# EAGLE design DAMAVA_02 (EAGLE 8.2.2)
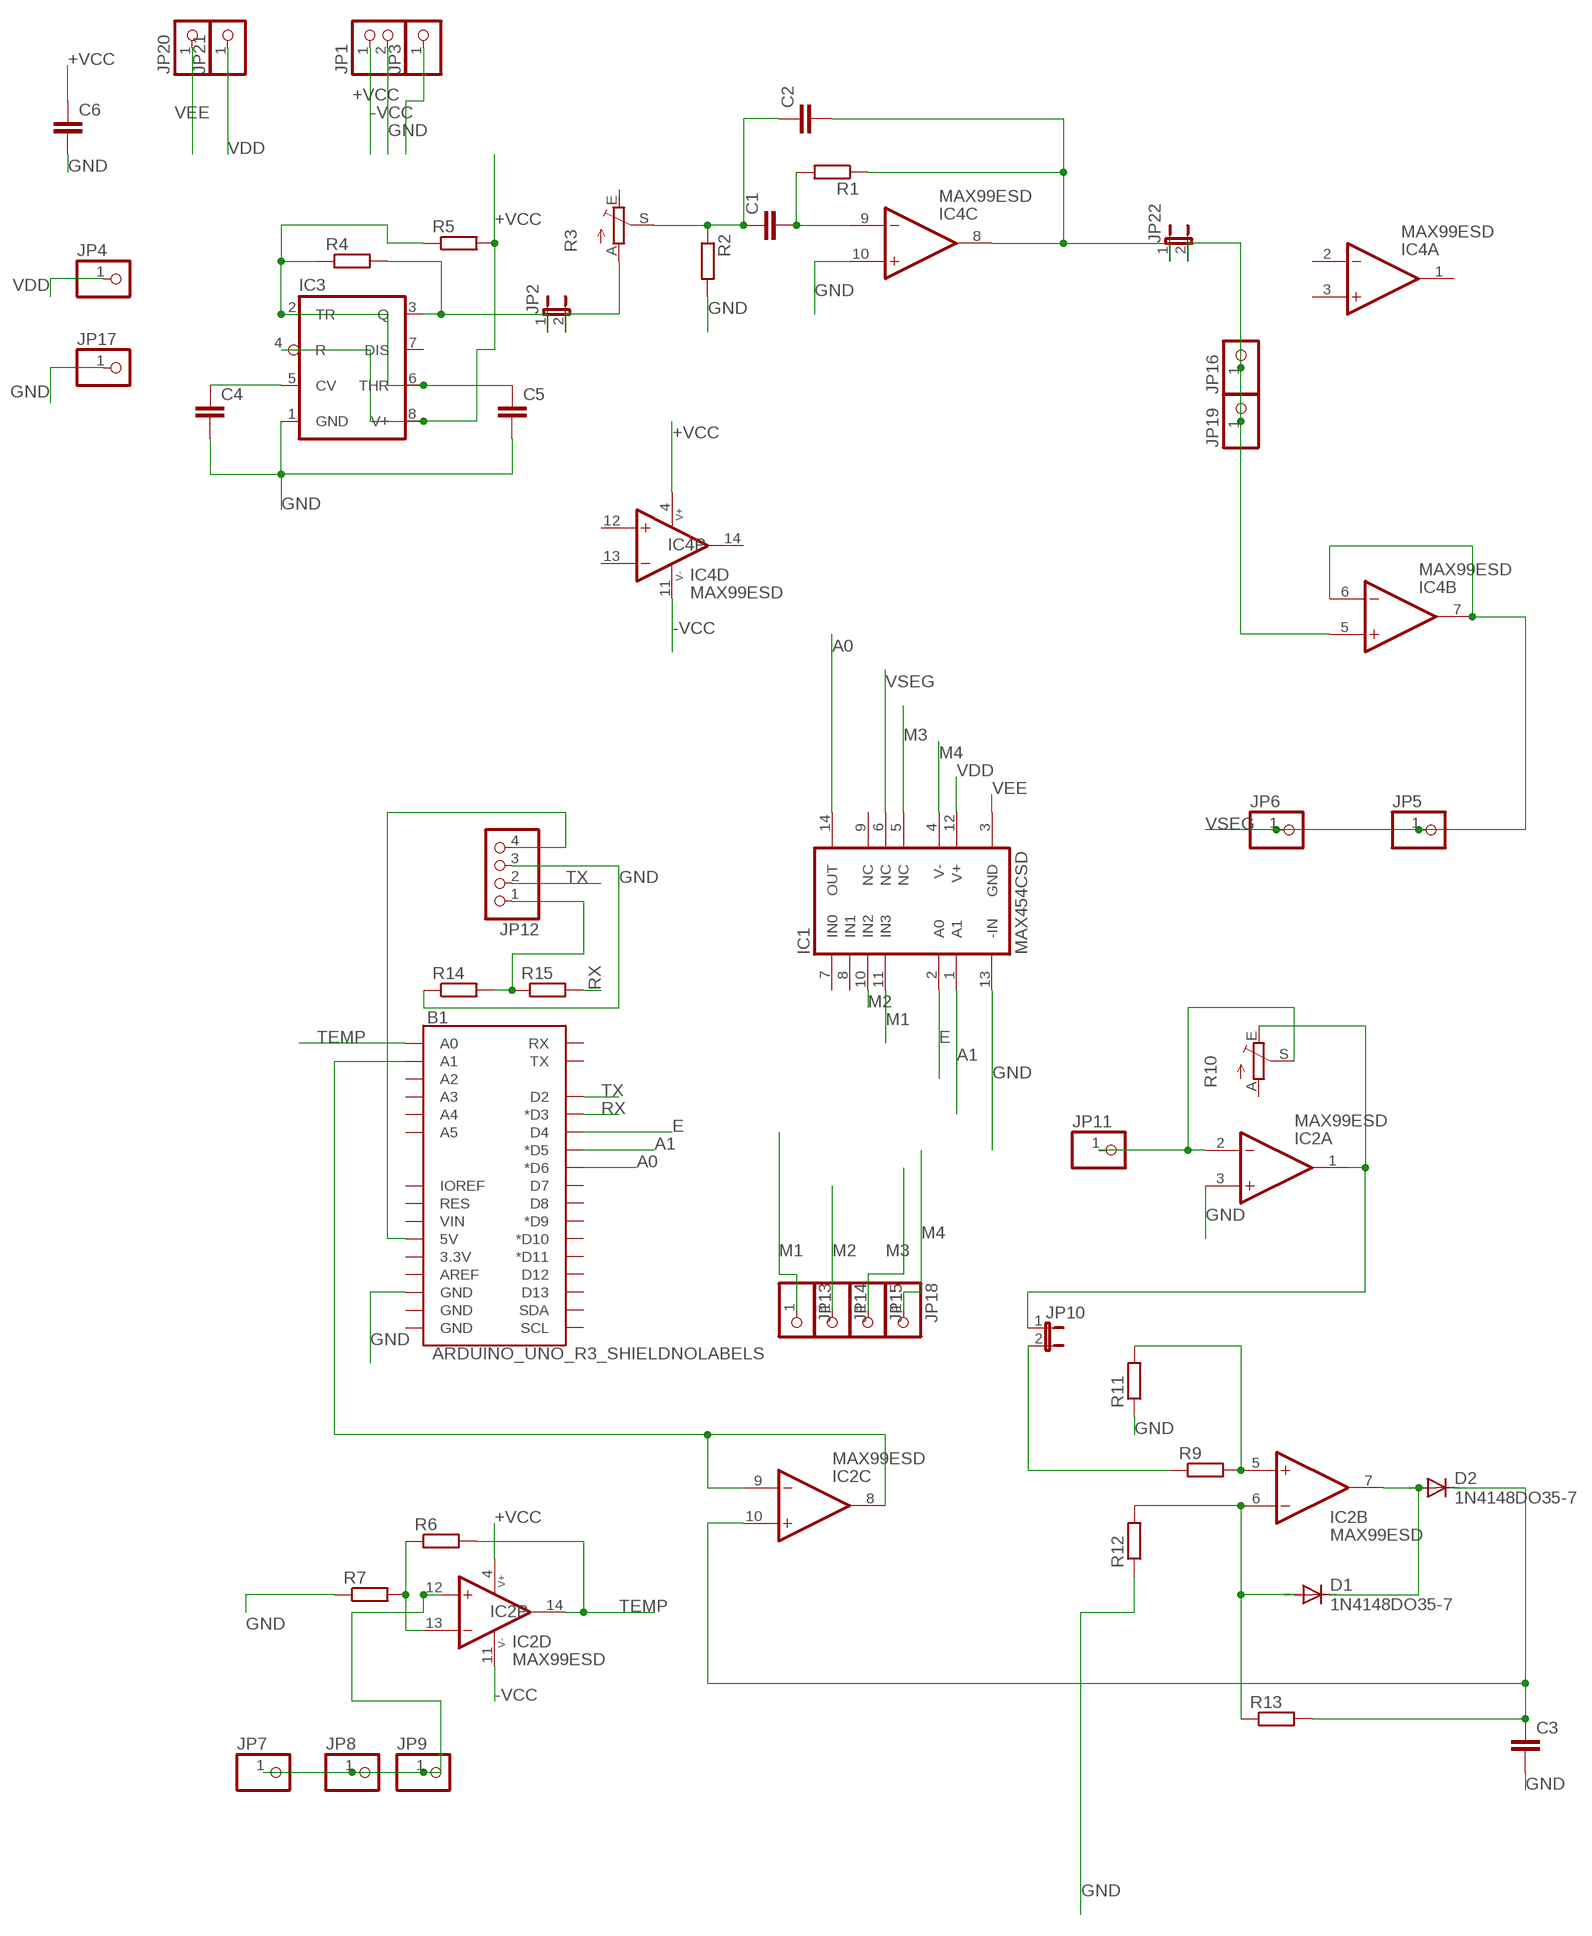
[diagram p0: schematic, sheet 1]

## Parts
B1  ARDUINO_UNO_R3_SHIELDNOLABELS  [UNO_R3_SHIELD_NOLABELS]
C1  C-EU050-024X044  [C050-024X044]
C2  C-EU050-024X044  [C050-024X044]
C3  C5/2.5  [C5B2.5]
C4  C-EU050-024X044  [C050-024X044]
C5  C-EU050-024X044  [C050-024X044]
C6  C-EU050-024X044  [C050-024X044]
D1  1N4148DO35-7  [DO35-7]
D2  1N4148DO35-7  [DO35-7]
IC1  MAX454CSD  [SO14]
IC2  MAX99ESD  [SO14]
IC3  TLC555DIL08-2  [DIL08-2]
IC4  MAX99ESD  [SO14]
JP1  PINHD-1X2  [1X02]
JP2  JP1E  [JP1]
JP3  PINHD-1X1  [1X01]
JP4  PINHD-1X1  [1X01]
JP5  PINHD-1X1  [1X01]
JP6  PINHD-1X1  [1X01]
JP7  PINHD-1X1  [1X01]
JP8  PINHD-1X1  [1X01]
JP9  PINHD-1X1  [1X01]
JP10  JP1E  [JP1]
JP11  PINHD-1X1  [1X01]
JP12  PINHD-1X4  [1X04]
JP13  PINHD-1X1  [1X01]
JP14  PINHD-1X1  [1X01]
JP15  PINHD-1X1  [1X01]
JP16  PINHD-1X1  [1X01]
JP17  PINHD-1X1  [1X01]
JP18  PINHD-1X1  [1X01]
JP19  PINHD-1X1  [1X01]
JP20  PINHD-1X1  [1X01]
JP21  PINHD-1X1  [1X01]
JP22  JP1E  [JP1]
R1  R-EU_0204/5  [0204/5]
R2  R-EU_0204/5  [0204/5]
R3  TRIM_EU-B90P  [SP19L]
R4  R-EU_0204/5  [0204/5]
R5  R-EU_0204/5  [0204/5]
R6  R-EU_0204/5  [0204/5]
R7  R-EU_0204/5  [0204/5]
R9  R-EU_0204/5  [0204/5]
R10  TRIM_EU-B90P  [SP19L]
R11  R-EU_0204/5  [0204/5]
R12  R-EU_0204/5  [0204/5]
R13  R-EU_0204/5  [0204/5]
R14  R-EU_0204/5  [0204/5]
R15  R-EU_0204/5  [0204/5]

## Nets
+VCC: C6.1 IC2.4(P:V+) IC3.4(R) IC3.8(V+) IC4.4(P:V+) JP1.1 R5.2
-VCC: IC2.11(P:V-) IC4.11(P:V-) JP1.2
A0: B1.D6(*D6) IC1.14(OUT)
A1: B1.D5(*D5) IC1.1(A1)
E: B1.D4 IC1.2(A0)
GND: B1.GND@2(GND) C3.2 C4.2 C5.2 C6.2 IC1.13(-IN) IC2.3(A:+IN) IC3.1(GND) IC4.10(C:+IN) JP3.1 JP12.3 JP17.1 R2.2 R7.1 R11.1 R12.1 R14.1
M1: IC1.11(IN3) JP13.1
M2: IC1.10(IN2) JP14.1
M3: IC1.5(NC) JP15.1
M4: IC1.4(V-) JP18.1
N$1: C1.2 IC4.9(C:-IN) R1.2
N$2: C1.1 C2.1 R2.1 R3.S
N$3: JP2.2 R3.A
N$4: C5.1 IC3.2(TR) IC3.6(THR) R4.1 R5.1
N$5: IC3.3(Q) JP2.1 R4.2
N$6: C3.1 D2.C IC2.10(C:+IN) R13.2
N$7: IC2.13(D:-IN) R6.1 R7.2
N$8: IC4.5(B:+IN) JP16.1 JP19.1 JP22.2
N$9: IC2.12(D:+IN) JP7.1 JP8.1 JP9.1
N$17: IC2.2(A:-IN) JP11.1 R10.S
N$19: B1.A1 IC2.8(C:OUT) IC2.9(C:-IN)
N$22: IC2.1(A:OUT) JP10.1 R10.E
N$23: IC2.5(B:+IN) R9.2 R11.2
N$24: JP10.2 R9.1
N$25: JP12.1 R14.2 R15.1
N$26: C2.2 IC4.8(C:OUT) JP22.1 R1.1
N$28: D1.A IC2.6(B:-IN) R12.2 R13.1
N$29: D1.C D2.A IC2.7(B:OUT)
N$31: B1.5V JP12.4
N$32: C4.1 IC3.5(CV)
RX: B1.D3(*D3) R15.2
TEMP: B1.A0 IC2.14(D:OUT) R6.2
TX: B1.D2 JP12.2
VDD: IC1.12(V+) JP4.1 JP21.1
VEE: IC1.3(GND) JP20.1
VSEG: IC1.6(NC) IC4.6(B:-IN) IC4.7(B:OUT) JP5.1 JP6.1
Unconnected: B1.3.3V B1.A2 B1.A3 B1.A4 B1.A5 B1.AREF B1.D7 B1.D8 B1.D9(*D9) B1.D10(*D10) B1.D11(*D11) B1.D12 B1.D13 B1.GND@0(GND) B1.GND@1(GND) B1.IOREF B1.RES B1.RX B1.SCL B1.SDA B1.TX B1.VIN IC1.7(IN0) IC1.8(IN1) IC1.9(NC) IC3.7(DIS) IC4.1(A:OUT) IC4.2(A:-IN) IC4.3(A:+IN) IC4.12(D:+IN) IC4.13(D:-IN) IC4.14(D:OUT) R3.E R10.A

## Library data of the parts
B1 = SparkFun-Boards:ARDUINO_UNO_R3_SHIELD: Arduino R3 Shield Footprint Shield form compatible with the Arduino Uno R3. SparkFun Products: MG2639 Cellular Shield <https://www.sparkfun.com/products/13120> MIDI Shield <https://www.sparkfun.com/products/12898> R3 Stackable Headers Kit <https://www.sparkfun.com/products/11417>
C1 C2 C4-C6 = resistor:C-EU: CAPACITOR, European symbol
C3 = capacitor-wima:C: CAPACITOR naming: grid - package width
D1 D2 = diode:1N4148: DIODE high speed (Philips)
IC1 = maxim:MAX454CSD: MULTIPLEXER; MPN: MAX454CSD+; OC_FARNELL: unknown; OC_NEWARK: 67K5327
IC2 IC4 = maxim:MAX99*: Micropower, Low-Voltage Rail-to-Rail I/O Comparators Source: http://pdfserv.maxim-ic.com/en/ds/MAX985-MAX994.pdf; OC_FARNELL: unknown; OC_NEWARK: unknown
IC3 = my_mixed:TLC555: CMOS 555 timer
JP1 = pinhead:PINHD-1X2: PIN HEADER
JP2 JP10 JP22 = jumper:JP1E: JUMPER
JP3-JP9 JP11 JP13-JP21 = pinhead:PINHD-1X1: PIN HEADER
JP12 = pinhead:PINHD-1X4: PIN HEADER
R1 R2 R4-R7 R9 R11-R15 = resistor:R-EU_: RESISTOR, European symbol
R3 R10 = pot:TRIM_EU-: POTENTIOMETER

## Module MUX
Ports: 

### Library data of the parts

## Board
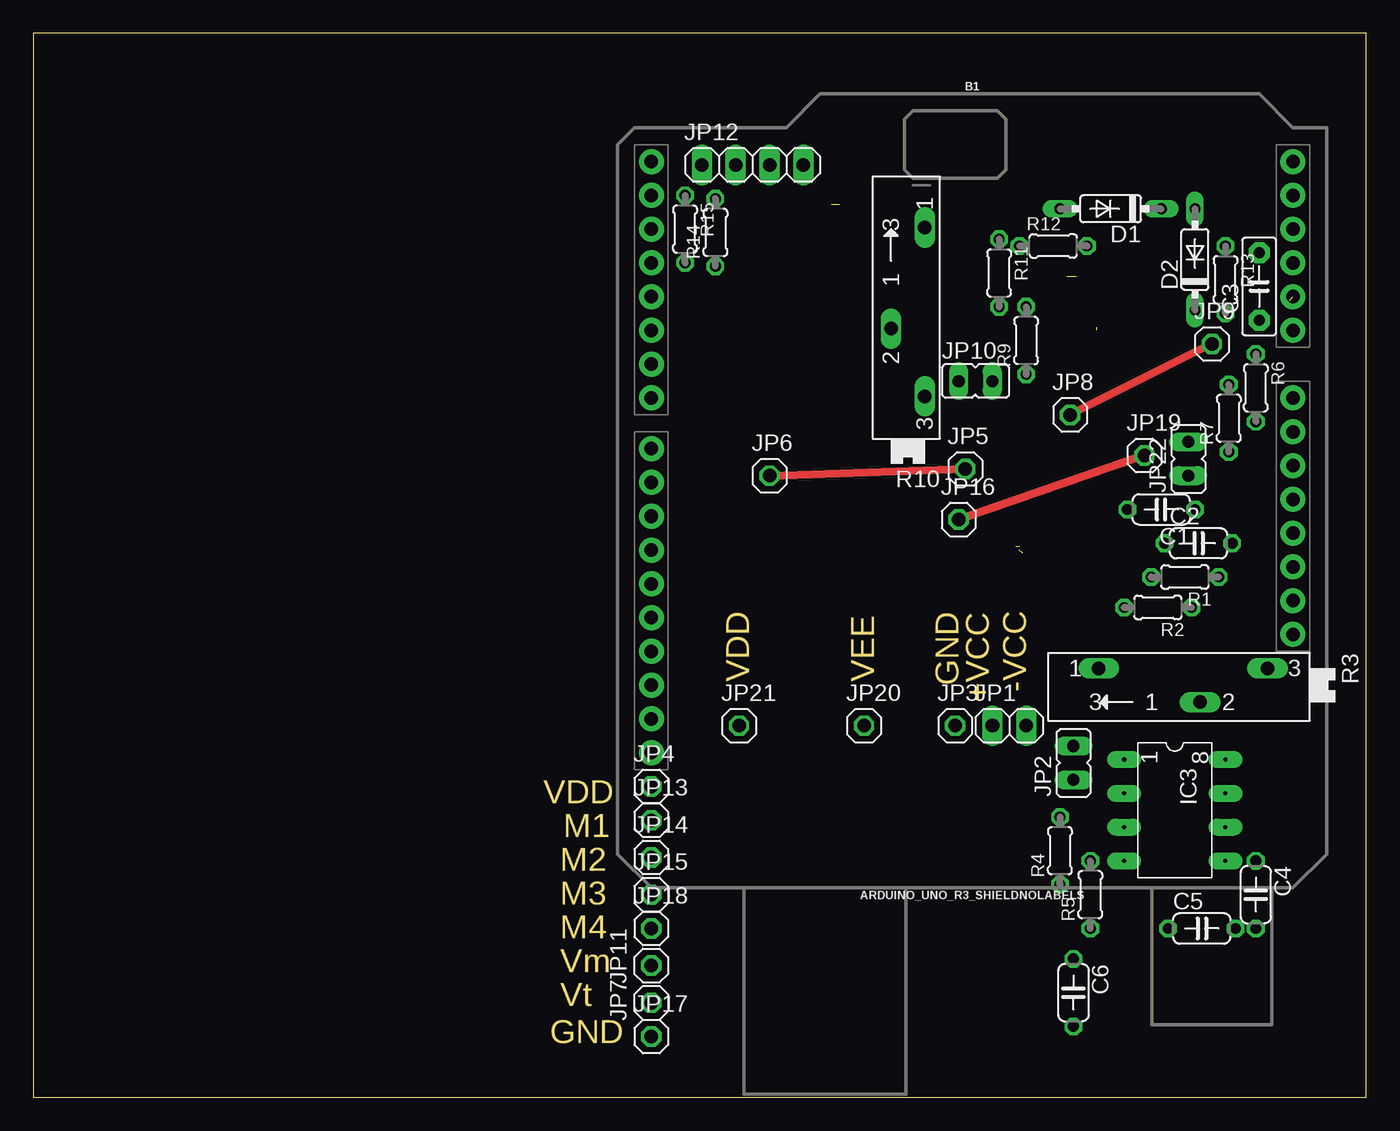
[diagram p1: board, top side]
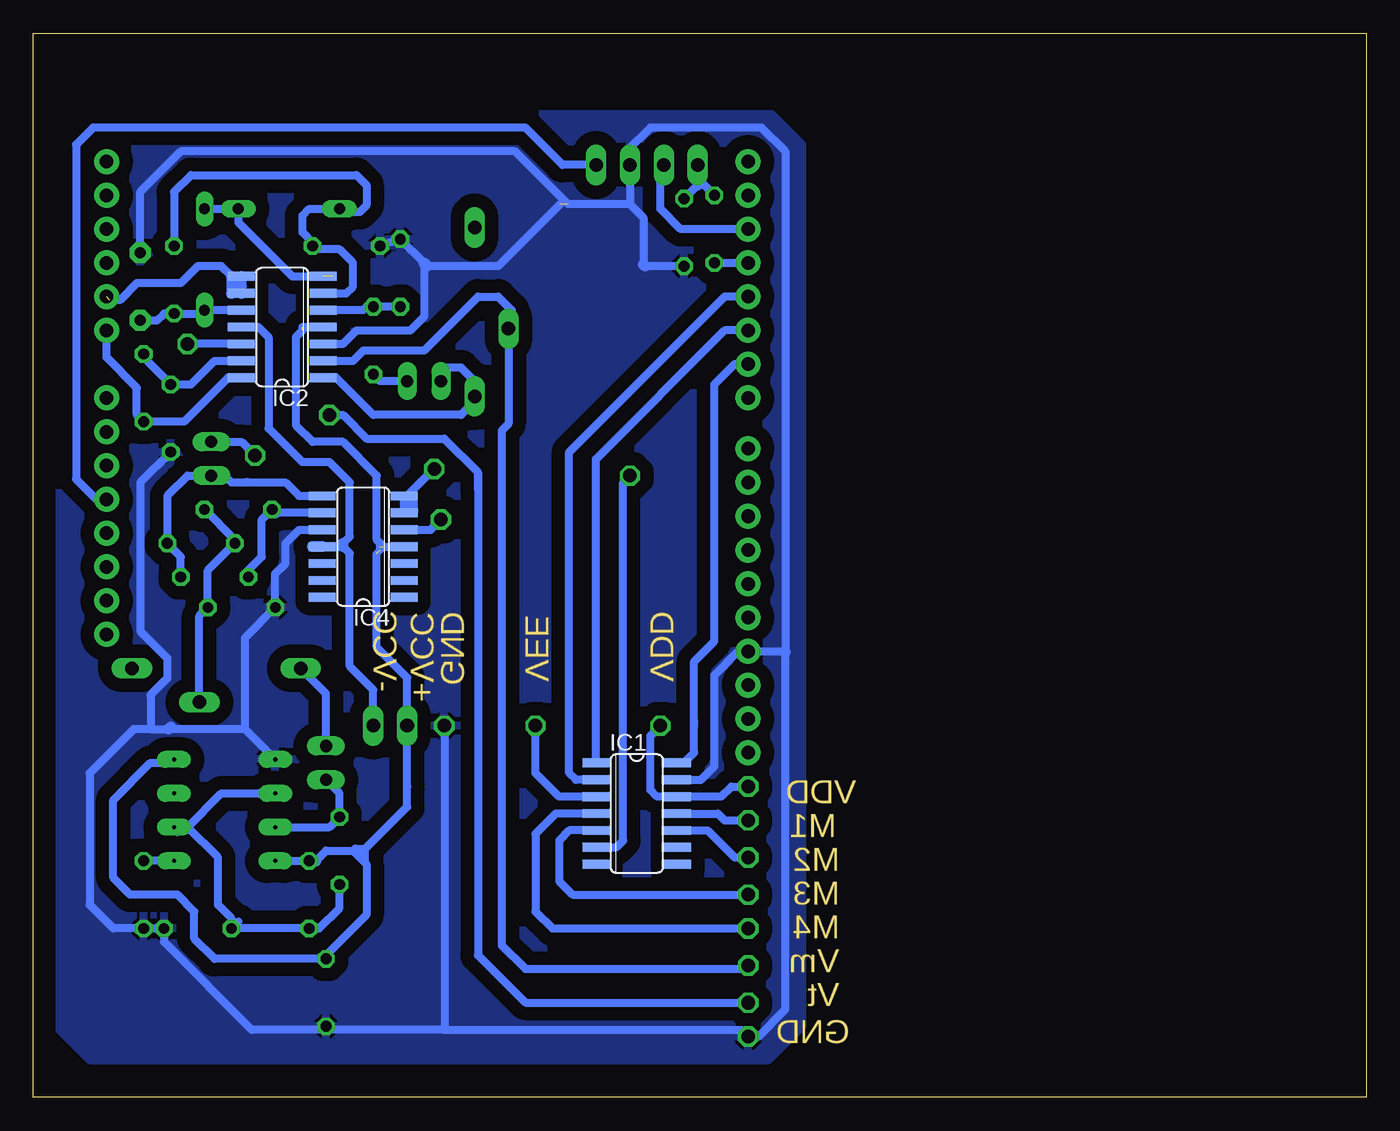
[diagram p2: board, bottom side, seen from below]

Size 100.25 x 80 mm. Coordinates in mm from the lower left corner, seen from the top.
Outline: 0,0 100.25,0 100.25,80 0,80 0,0
Copper layers (1*16): Top 0.035mm / dielectric 1.5mm / Bottom 0.035mm
Design rules "default": minimum track width 6mil, minimum drill 0.35mm, track to track 6mil, track to pad 6mil, pad to pad 6mil, via to via 6mil, smd to smd 6mil, copper to edge 40mil, drill to drill 6mil, minimum pad ring 10mil, minimum via ring 8mil, stop-mask expansion 4mil, vias tented up to drill 0mil, thermal gap 10mil

### Footprints (pad centres in the part's own frame; a part is rotated, then mirrored left to right if it is on the bottom)
UNO_R3_SHIELD_NOLABELS = drill 1.016 pad 1.88: 3.3V 24.13,-3.81; 5V 24.13,-1.27; A0 24.13,11.43; A1 24.13,13.97; A2 24.13,16.51; A3 24.13,19.05; A4 24.13,21.59; A5 24.13,24.13; AREF -24.13,-15.24; D2 -24.13,19.05; D3 -24.13,16.51; D4 -24.13,13.97; D5 -24.13,11.43; D6 -24.13,8.89; D7 -24.13,6.35; D8 -24.13,2.54; D9 -24.13,0; D10 -24.13,-2.54; D11 -24.13,-5.08; D12 -24.13,-7.62; D13 -24.13,-10.16; GND@0 24.13,1.27; GND@1 24.13,3.81; GND@2 -24.13,-12.7; IOREF 24.13,-8.89; NC 24.13,-11.43; RES 24.13,-6.35; RX -24.13,24.13; SCL -24.13,-20.32; SDA -24.13,-17.78; TX -24.13,21.59; VIN 24.13,6.35
C050-024X044 = drill 0.813 octagon: 1 -2.54,0; 2 2.54,0
C5B2.5 = drill 0.813 pad 1.6 octagon: 1 -2.54,0; 2 2.54,0
DO35-7 = drill 0.813 long: A 3.81,0; C -3.81,0
SO14 = smd 0.66 x 2.032: 1 -3.81,-3.073; 2 -2.54,-3.073; 3 -1.27,-3.073; 4 0,-3.073; 5 1.27,-3.073; 6 2.54,-3.073; 7 3.81,-3.073; 8 3.81,3.073; 9 2.54,3.073; 10 1.27,3.073; 11 0,3.073; 12 -1.27,3.073; 13 -2.54,3.073; 14 -3.81,3.073
DIL08-2 = drill 0.305 pad 1.27 long: 1 -3.81,-3.81; 2 -1.27,-3.81; 3 1.27,-3.81; 4 3.81,-3.81; 5 3.81,3.81; 6 1.27,3.81; 7 -1.27,3.81; 8 -3.81,3.81
1X02 = drill 1.016 long: 1 -1.27,0; 2 1.27,0
JP1 = drill 0.914 long: 1 0,-1.27; 2 0,1.27
1X01 = drill 1.016 octagon: 1 0,0
1X04 = drill 1.016 long: 1 -3.81,0; 2 -1.27,0; 3 1.27,0; 4 3.81,0
0204/5 = drill 0.813 octagon: 1 -2.54,0; 2 2.54,0
SP19L = drill 1.016 long: A 5.715,-1.27; E -6.985,-1.27; S -1.905,1.27

### Placement (x,y rotation side)
B1  70.61,46.23 0 top
C1  84.84,44.2 180 top
C2  87.63,41.66 0 top
C3  92.2,60.96 90 top
C4  91.95,15.24 270 top
C5  87.88,12.7 0 top
C6  78.23,7.87 270 top
D1  81.03,66.8 180 top
D2  87.38,62.99 90 top
IC1  54.86,21.34 270 bottom
IC2  81.53,57.91 90 bottom
IC3  85.85,21.59 270 top
IC4  75.44,41.4 90 bottom
JP1  73.41,27.94 0 top
JP2  78.23,25.15 0 top
JP3  69.34,27.94 0 top
JP4  46.48,23.37 0 top
JP5  70.1,47.24 0 top
JP6  55.37,46.74 0 top
JP7  46.48,7.11 90 top
JP8  77.98,51.31 0 top
JP9  88.65,56.64 0 top
JP10  70.87,53.85 270 top
JP11  46.48,9.91 90 top
JP12  54.1,70.1 0 top
JP13  46.48,20.83 0 top
JP14  46.48,18.03 0 top
JP15  46.48,15.24 0 top
JP16  69.6,43.43 0 top
JP17  46.48,4.57 0 top
JP18  46.48,12.7 0 top
JP19  83.57,48.26 0 top
JP20  62.48,27.94 0 top
JP21  53.09,27.94 0 top
JP22  86.87,48.01 0 top
R1  86.61,39.12 180 top
R2  84.58,36.83 180 top
R3  85.85,30.99 180 top
R4  77.22,18.54 90 top
R5  79.5,15.24 90 top
R6  91.95,53.34 270 top
R7  89.92,51.05 90 top
R9  74.68,56.9 90 top
R10  65.79,59.69 90 top
R11  72.64,61.98 270 top
R12  76.71,64.01 0 top
R13  89.66,61.47 270 top
R14  51.31,65.02 90 top
R15  49.02,65.28 270 top

### Tracks (layer width: path | path; a pad name or v marks a point on that pad's centre or on a via)
+VCC  (3 unrouted)
  Bottom 0.61: IC3.4 R5.2 | 78.99,17.78 78.23,18.54 76.2,18.54 | 76.2,18.54 75.82,18.16 | 75.82,18.16 75.28,17.62 | 78.49,10.41 75.18,13.72 75.18,17.53 75.28,17.62 | 78.49,10.41 86.61,10.41 88.14,11.94 88.14,13.97 89.41,15.24 92.96,15.24 94.23,16.51 94.23,22.35 91.44,25.15 89.92,25.15 IC3.8 | IC4.4 73.91,41.4 74.42,41.91 74.42,46.74 76.96,49.28 79.25,49.28 80.52,50.55 80.52,57.15 80.01,57.66 | 80.01,57.91 IC2.4 77.72,57.91 | 74.17,41.15 74.17,41.4 | 74.42,40.89 74.42,33.85 72.14,31.56 JP1.1 | C6.1 78.49,10.41 | 75.82,18.16 75.28,18.7 | 72.14,23.37 JP1.1 | 75.28,17.62 75.28,18.7 | 76.2,18.54 76.04,18.7 75.28,18.7 | 75.28,18.7 72.14,21.84 JP1.1
  Bottom 0.813: R5.2 78.99,17.78
-VCC
  Bottom 0.61: IC4.11 76.96,41.4 76.45,40.89 76.45,32.42 74.68,30.64 JP1.2 | 76.96,41.66 76.45,42.16 76.45,46.23 77.98,47.75 80.01,47.75 82.55,50.29 82.55,57.15 83.31,57.91 IC2.11 85.34,57.91
  Bottom 0.813: 76.96,41.4 76.96,41.66 | IC4.11 79.25,41.4
A0
  Bottom 0.61: 50.55,28.28 50.55,27.94 | 50.55,28.28 50.55,32.77 49.02,34.29 49.02,53.59 47.5,55.12 B1.D6 | IC1.14 51.31,25.15 50.55,25.91 50.55,28.28
A1
  Bottom 0.61: B1.D5 48.26,57.66 57.94,47.98 IC1.1
E
  Bottom 0.61: B1.D4 48.26,60.2 59.94,48.51 59.94,24.38 59.44,23.88 IC1.2
GND  (1 unrouted)
  Bottom 0.61: 43.73,33.53 B1.GND@2 47.24,33.53 49.02,31.75 49.02,24.89 50.04,23.88 IC1.13 | 54.36,62.61 54.36,66.13 55.37,67.15 | R14.1 54.23,62.48 | C3.2 92.2,68.07 89.15,71.12 64.01,71.12 60.03,67.15 55.37,67.15 | R12.1 R11.1 70.87,62.74 70.87,58.67 71.88,57.66 75.95,57.66 76.96,56.64 IC2.3 | 55.37,67.15 JP12.3 55.63,70.36 55.63,71.12 53.85,72.9 45.47,72.9 43.69,71.12 43.69,33.48 43.69,6.61 45.72,4.57 JP17.1 46.99,5.08 69.32,5.08 | 60.62,67.15 65.28,62.48 70.61,62.48 | R7.1 92.2,46.23 92.2,35.05 90.17,33.02 90.17,31.5 91.44,30.23 91.44,30.22 91.44,27.69 | IC4.10 80.26,42.67 81.28,41.66 81.28,40.13 82.04,39.37 R2.2 84.33,34.54 84.33,27.69 | 91.44,27.69 90.07,27.69 84.33,27.69 | 91.44,27.69 92.71,27.69 96.01,24.38 96.01,14.48 94.23,12.7 C4.2 C5.2 90.42,11.68 83.82,5.08 78.49,5.08 | 78.49,5.08 C6.2 | 69.32,5.08 78.49,5.08 | JP3.1 69.32,27.67 69.32,5.08 | IC3.1 84.33,27.69
  Bottom 0.813: 43.73,33.53 43.69,33.48 | 54.23,62.48 54.36,62.61 | 92.2,12.7 C4.2 | 70.61,62.48 70.87,62.74 | 89.92,27.84 90.07,27.69
  pour Bottom (isolate 1.016): 42.42,28.96 42.42,71.37 42.42,71.63 44.7,73.91 96.52,73.91 98.3,72.14 98.3,5.08 96.01,2.79 44.96,2.79 42.42,5.33 42.42,28.45
M1
  Bottom 0.61: IC1.11 48.77,21.34 48.26,20.83 JP13.1
M2
  Bottom 0.61: IC1.10 49.53,20.07 47.5,18.03 JP14.1
M3
  Bottom 0.61: IC1.5 59.94,20.07 60.71,19.3 60.71,16.26 59.69,15.24 JP15.1
M4
  Bottom 0.61: IC1.4 60.96,21.34 62.48,19.81 62.48,13.97 61.21,12.7 JP18.1
N$1
  Bottom 0.61: R1.2 84.07,39.62 83.06,40.64 83.06,43.43 C1.2 | IC4.9 82.04,43.94
  Bottom 0.813: 84.07,39.37 R1.2 | C1.2 82.04,43.94 C1.2
N$2
  Bottom 0.61: C1.1 85.09,41.91 C2.1 87.12,39.62 R2.1 87.76,36.2 R3.S
  Bottom 0.813: R2.1 87.12,36.7
N$3
  Bottom 0.61: JP2.2 78.23,30.35 R3.A
N$4
  Bottom 0.61: R4.1 77.22,14.22 78.74,12.7 R5.1 C5.1 | 84.84,13.21 C5.1 | 88.39,20.07 89.41,20.07 | 88.65,20.32 IC3.6 | 88.65,20.32 86.11,22.86 IC3.2 | C5.1 85.34,13.46 86.36,14.48 86.36,18.03 88.65,20.32
  Bottom 0.813: IC3.2 83.06,22.86 | 89.41,20.07 IC3.6
N$5
  Bottom 0.61: IC3.3 77.98,20.32 R4.2 77.22,22.86 JP2.1
N$6
  Bottom 0.61: C3.1 90.93,58.42 90.42,58.93 R13.2 87.63,58.93 | IC2.10 D2.C
  Bottom 0.813: 87.63,58.93 D2.C 87.38,58.67
N$7
  Bottom 0.61: IC2.13 86.61,55.37 88.39,53.59 R7.2 91.95,55.63 R6.1
N$8
  Top 0.61: JP19.1 JP16.1
  Bottom 0.61: JP22.2 84.58,49.28 JP19.1 | IC4.5 70.36,42.67 JP16.1
N$9
  Top 0.61: JP9.1 JP8.1
  Bottom 0.61: JP7.1 63.25,7.11 66.8,10.67 66.8,45.74 | IC2.12 JP9.1 | JP8.1 76.96,51.31 75.18,49.53 69.34,49.53 66.8,46.99 | 66.8,45.74 66.8,46.99 | 66.8,46.99 66.8,45.74
N$17
  Bottom 0.61: JP11.1 46.74,9.65 63.25,9.65 65.02,11.43 65.02,50.12 64.52,50.63 64.52,57.38 | IC2.2 76.2,55.37 75.44,56.13 70.87,56.13 66.8,60.2 65.28,60.2 64.26,59.18 64.26,57.63
  Bottom 0.813: 64.52,57.91 R10.S | 64.64,57.66 R10.S | R10.S 64.52,57.38 64.26,57.63
N$19  (1 unrouted)
  Bottom 0.61: B1.A1 94.23,60.2 | 85.34,60.45 IC2.9 | IC2.8 85.34,61.72 86.11,62.48 87.88,62.48 89.15,61.21 92.46,61.21 93.73,59.94 94.49,59.94
  Bottom 0.813: IC2.8 IC2.9 84.61,60.98 85.34,61.72 85.34,60.45
N$22
  Bottom 0.61: R10.E 67.06,53.85 68.07,54.86 69.6,54.86 JP10.1 | 67.06,52.32 68.07,51.31 74.68,51.31 77.47,54.1 IC2.1
  Bottom 0.813: R10.E 67.06,52.32
N$23
  Bottom 0.61: IC2.5 75.44,59.18 75.18,59.44 R9.2 R11.2
N$24
  Bottom 0.61: JP10.2 74.17,53.85 R9.1
N$25
  Bottom 0.61: 50.29,69.09 R15.1 | 50.29,68.58 R14.2
  Bottom 0.813: 50.29,69.09 JP12.1 50.29,68.58
N$26
  Bottom 0.61: R1.1 89.15,40.64 C2.2 90.17,45.21 88.65,46.74 JP22.1 85.85,46.74 85.34,46.23 84.04,46.23 | IC4.8 80.26,45.21 81.28,46.23 84.04,46.23 | 84.04,46.23 84.33,46.23
N$28
  Bottom 0.61: IC2.6 76.71,60.45 76.2,60.96 76.2,62.74 77.22,63.75 78.99,63.75 R12.2 79.25,64.26 80.01,65.02 80.01,66.29 79.5,66.8 D1.A 76.61,66.8 | R13.1 89.66,68.07 88.39,69.34 75.95,69.34 75.18,68.58 75.18,67.06 75.69,66.55 76.35,66.55 76.61,66.8 | 76.61,66.8 76.2,66.8
N$29  (1 unrouted)
  Bottom 0.61: D2.A D1.C 84.84,65.79 80.77,61.72 79.5,61.72 77.72,61.72
N$31
  Bottom 0.61: B1.5V 95.5,44.96 97.03,46.48 97.03,71.63 95.76,72.9 63.25,72.9 60.45,70.1 JP12.4
N$32
  Bottom 0.61: IC3.5 C4.1
RX
  Bottom 0.61: R15.2 B1.D3
TEMP
  Bottom 0.61: IC2.14 85.6,54.1 88.9,50.8 R6.2 92.46,51.31 92.46,53.34 94.74,55.63 B1.A0
TX
  Bottom 0.61: B1.D2 51.56,65.28 53.09,66.8 53.09,69.85
  Bottom 0.813: 53.09,69.85 JP12.2
VDD
  Bottom 0.61: JP4.1 47.75,23.37 48.51,22.61 IC1.12 53.34,22.61 53.85,23.11 53.85,27.18 JP21.1
VEE
  Bottom 0.61: IC1.3 60.71,22.61 62.48,24.38 JP20.1
VSEG
  Top 0.61: JP6.1 JP5.1
  Bottom 0.61: 71.95,45.4 72.14,45.21 IC4.7 | 71.95,45.4 JP5.1 | IC4.7 IC4.6 71.63,43.94 71.63,44.27 | 71.63,44.27 71.63,45.08 71.95,45.4 | IC4.7 72.37,45 71.63,44.27 | IC1.6 56.39,18.8 55.88,19.3 55.88,46.23 JP6.1

### Text on the board
Milling: VDD | VEE | GND | +VCC | -VCC | VDD | M1 | M2 | M3 | M4 | Vm | Vt | GND